# EAGLE design FPGA-m3pi (EAGLE 6.3)
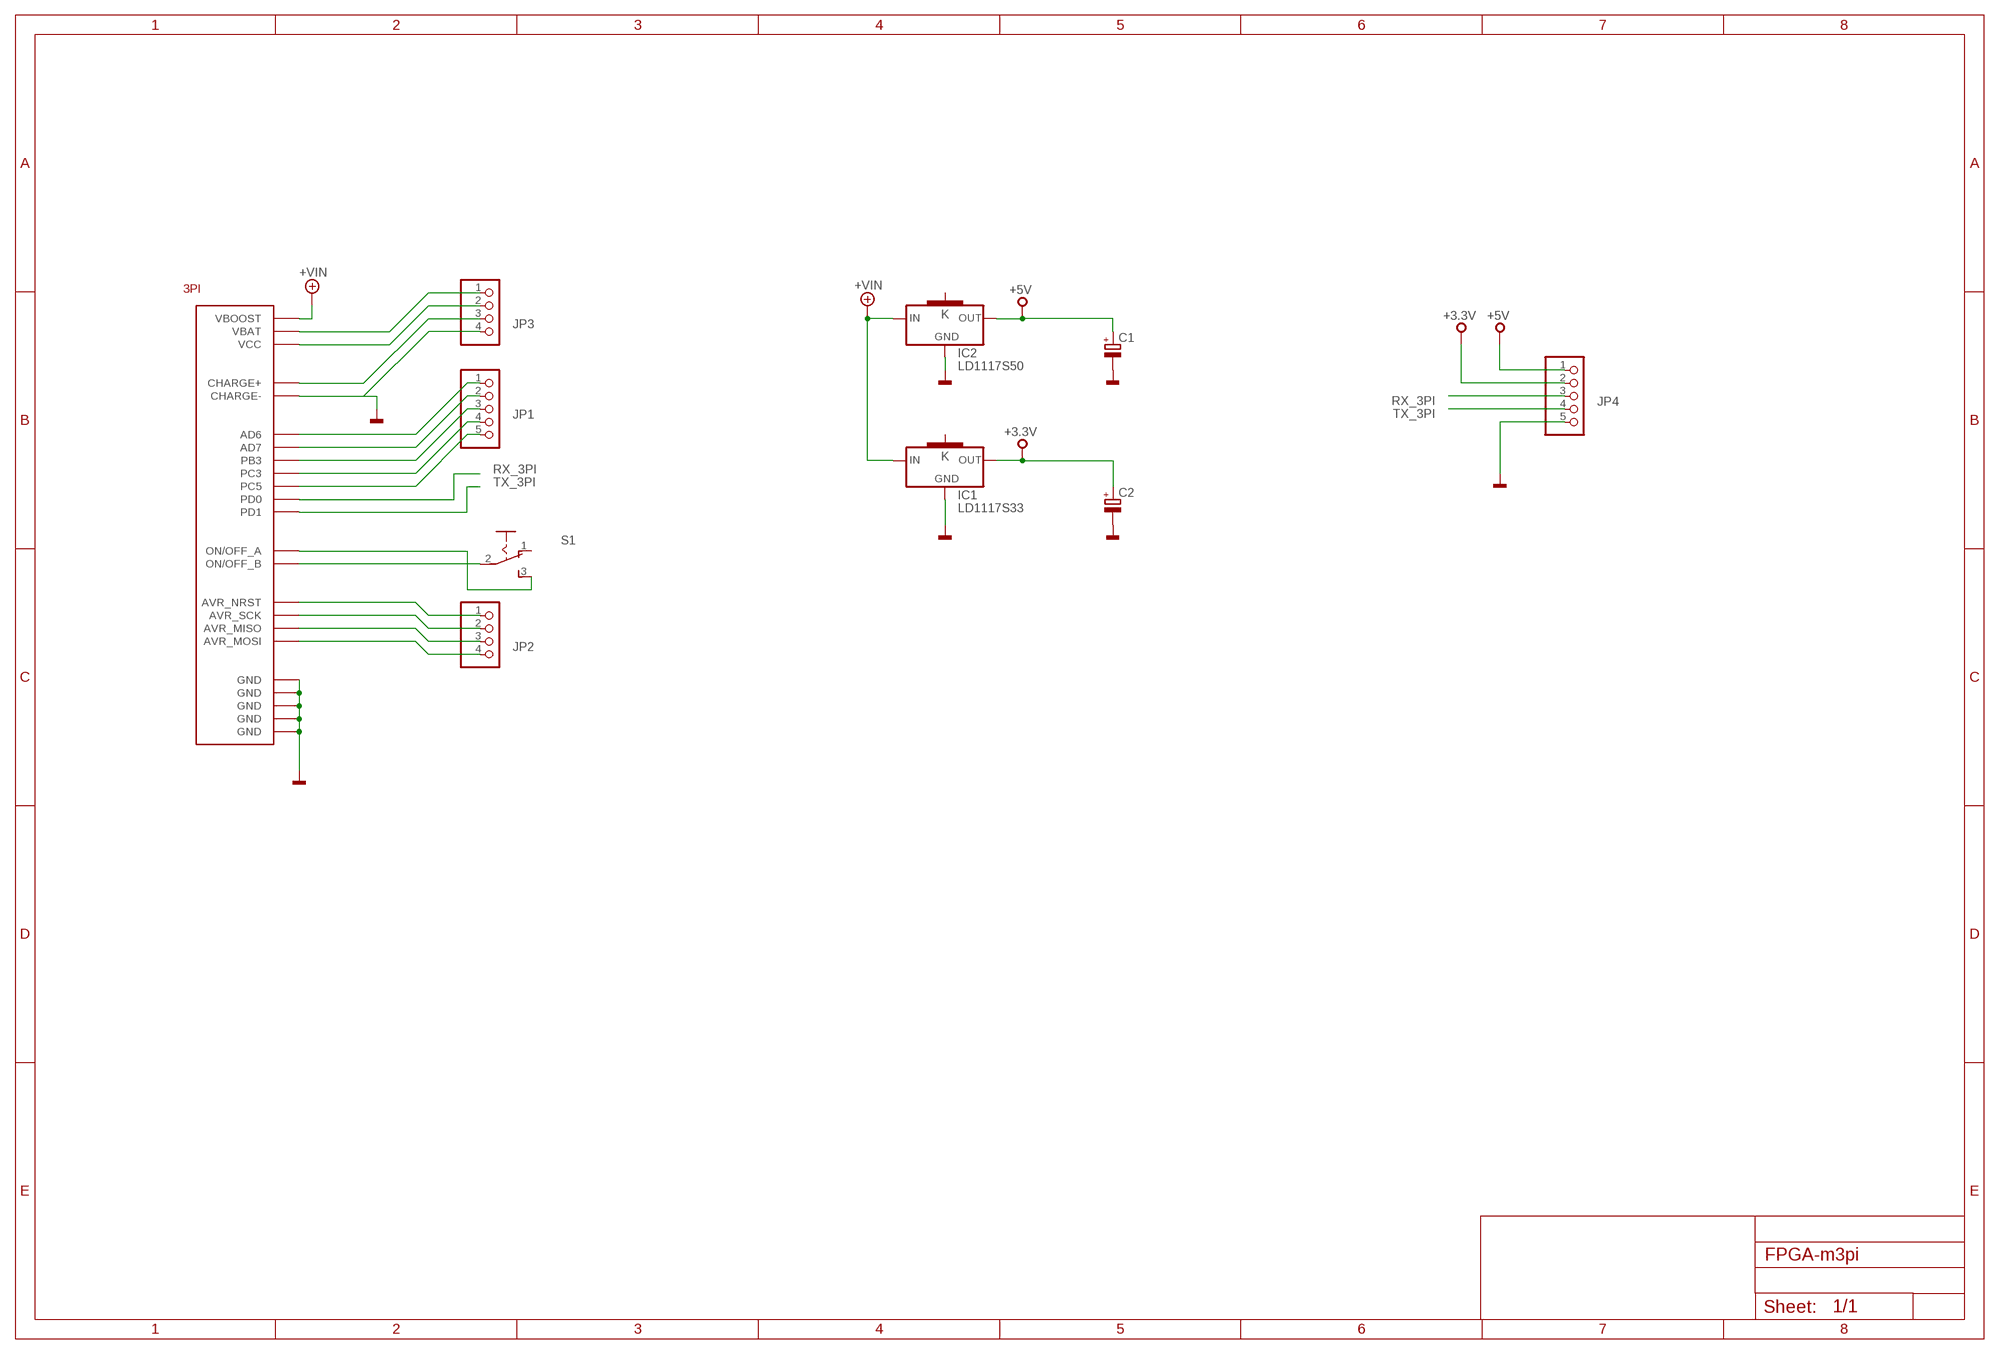
[diagram p0: schematic, sheet 1]

## Parts
C1  CPOL-EUE2.5-5  [E2,5-5]
C2  CPOL-EUE2.5-5  [E2,5-5]
IC1  LD1117S33  [SOT223]
IC2  LD1117S50  [SOT223]
JP1  PINHD-1X5  [1X05]
JP2  PINHD-1X4  [1X04]
JP3  PINHD-1X4  [1X04]
JP4  PINHD-1X5  [1X05]
S1  M251  [M251]
U$1  MBED-M3PI_3PI  [MBED-M3PI_3PI]

## Nets
+3,3V: C2.+ IC1.2(OUT) JP4.2 ; supply symbol labelled +3.3V
+5V: C1.+ IC2.2(OUT) JP4.1
+VIN: IC1.3(IN) IC2.3(IN) U$1.VBOOST
GND: C1.- C2.- IC1.1(GND) IC2.1(GND) JP3.4 JP4.5 U$1.CHARGE- U$1.GND@1(GND) U$1.GND@2(GND) U$1.GND@3(GND) U$1.GND@4(GND) U$1.GND@5(GND)
N$1: JP1.1 U$1.AD6
N$2: JP1.2 U$1.AD7
N$3: S1.2(P) U$1.ON/OFF_B
N$4: S1.3(S) U$1.ON/OFF_A
N$5: JP1.3 U$1.PB3
N$6: JP1.4 U$1.PC3
N$7: JP1.5 U$1.PC5
N$8: JP2.1 U$1.AVR_NRST
N$9: JP2.2 U$1.AVR_SCK
N$10: JP2.3 U$1.AVR_MISO
N$11: JP2.4 U$1.AVR_MOSI
N$12: JP3.3 U$1.CHARGE+
N$13: JP3.2 U$1.VCC
N$14: JP3.1 U$1.VBAT
RX_3PI: JP4.3 U$1.PD0
TX_3PI: JP4.4 U$1.PD1
Unconnected: IC1.4(K) IC2.4(K) S1.1(O)

## Library data of the parts
C1 C2 = rcl:CPOL-EU: POLARIZED CAPACITOR, European symbol
IC1 = mbed-ics:LD1117S33: VOLTAGE REGULATOR SMD 3,3V
IC2 = mbed-ics:LD1117S50: VOLTAGE REGULATOR SMD 5V
JP1 JP4 = pinhead:PINHD-1X5: PIN HEADER
JP2 JP3 = pinhead:PINHD-1X4: PIN HEADER
S1 = switch:M251: SLIDING SWITCH Mors, distributor Buerklin, 11G702
U$1 = m3pi:MBED-M3PI_3PI

## Board
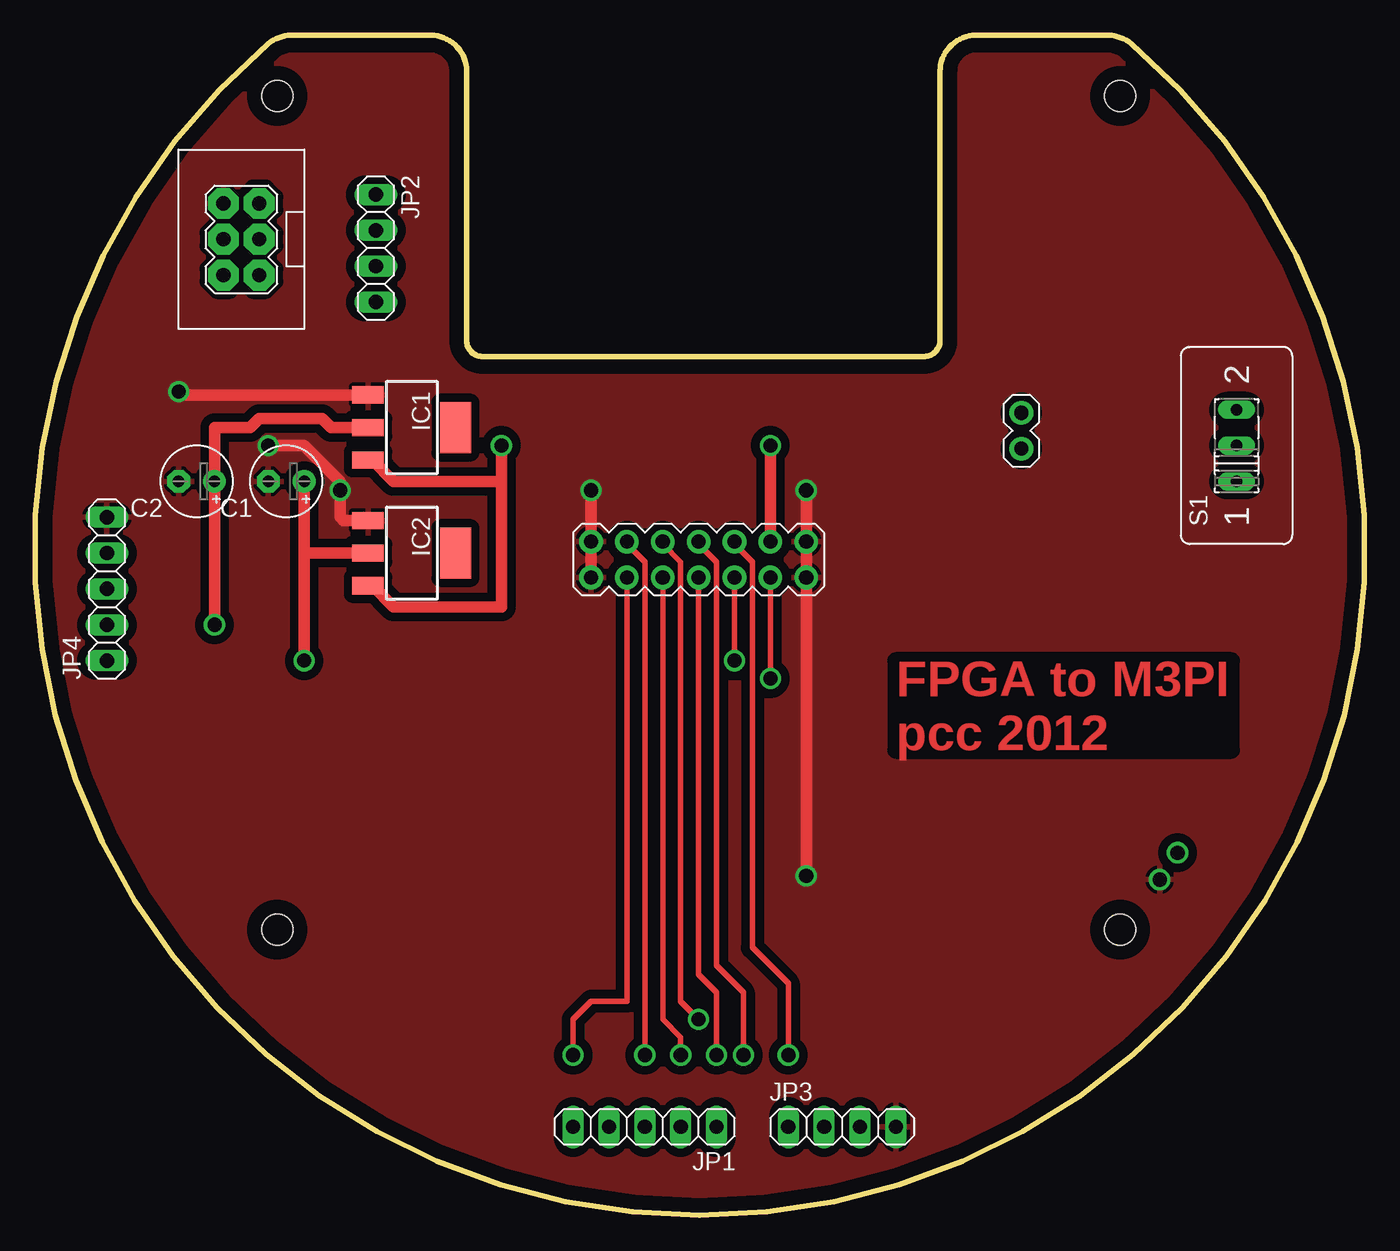
[diagram p1: board, top side]
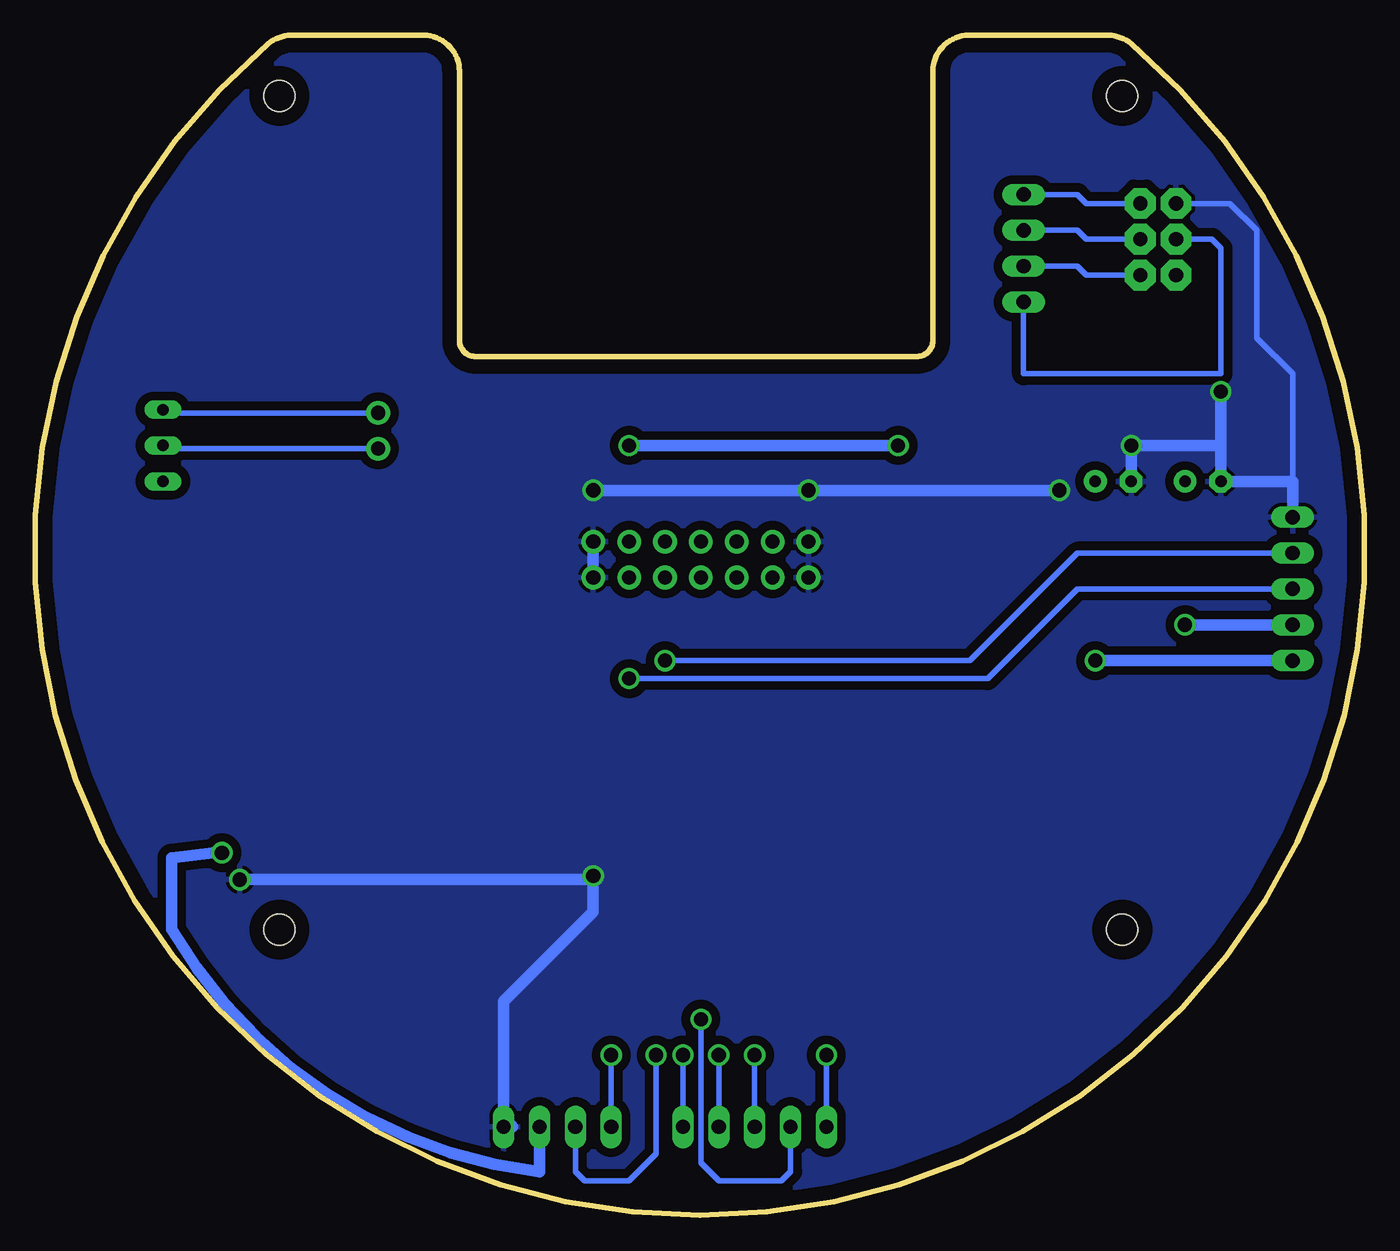
[diagram p2: board, bottom side, seen from below]

Size 94.12 x 83.58 mm. Coordinates in mm from the lower left corner, seen from the top.
Copper layers (1*16): Top 0.035mm / dielectric 1.5mm / Bottom 0.035mm
Design rules "default": minimum track width 10mil, minimum drill 24mil, track to track 8mil, track to pad 8mil, pad to pad 8mil, via to via 8mil, smd to smd 8mil, copper to edge 40mil, drill to drill 8mil, minimum pad ring 10mil, minimum via ring 8mil, stop-mask expansion 4mil, vias tented up to drill 0mil, thermal gap 10mil

### Footprints (pad centres in the part's own frame; a part is rotated, then mirrored left to right if it is on the bottom)
E2,5-5 = drill 0.813 pad 1.6: + -1.27,0 | drill 0.813 pad 1.6 octagon: - 1.27,0
SOT223 = smd 1.219 x 2.235: 1 -2.311,-3.099; 2 0,-3.099; 3 2.311,-3.099 | smd 3.6 x 2.2: 4 0,3.099
1X05 = drill 1.016 long: 1 -5.08,0; 2 -2.54,0; 3 0,0; 4 2.54,0; 5 5.08,0
1X04 = drill 1.016 long: 1 -3.81,0; 2 -1.27,0; 3 1.27,0; 4 3.81,0
M251 = drill 0.813 long: 1 -2.54,0; 2 0,0; 3 2.54,0
MBED-M3PI_3PI = drill 1 pad 1.676: AD6 0,-16.97; AD7 -2.54,-16.97; GND@1 -7.62,-14.43; GND@2 -7.62,-16.97; GND@3 7.62,-14.43; GND@4 7.62,-16.97; ON/OFF_A 22.86,-5.31; ON/OFF_B 22.86,-7.85; PB3 -5.08,-14.43; PC3 -2.54,-14.43; PC5 -5.08,-16.97; PD0 5.08,-16.97; PD1 2.54,-16.97; VBAT 2.54,-14.43; VBOOST 5.08,-14.43; VCC 0,-14.43 | drill 1 pad 2.184 octagon: AVR_MISO -31.115,4.445; AVR_MOSI -33.655,6.985; AVR_NRST -31.115,9.525; AVR_SCK -31.115,6.985; GND@5 -33.655,9.525; P$2 -33.655,4.445 | drill 1: CHARGE+ 33.925,-36.465; CHARGE- 32.655,-38.37 | hole 2.2: -29.845,-41.91; 29.845,-41.91; 29.845,17.145; -29.845,17.145

### Placement (x,y rotation side)
C1  17.77,51.98 180 top
C2  11.42,51.98 180 top
IC1  26.66,55.79 270 top
IC2  26.66,46.9 270 top
JP1  43.17,6.26 180 top
JP2  24.12,68.49 270 top
JP3  57.14,6.26 0 top
JP4  5.07,44.36 90 top
S1  85.08,54.52 90 top
U$1  46.98,62.14 0 top

### Tracks (layer width: path | path; a pad name or v marks a point on that pad's centre or on a via)
+3,3V  (via drill 1 pad 1.27)
  Top 0.813: v12.69,41.82 C2.+ 12.69,55.79 15.23,55.79 15.87,56.43 20.31,56.43 20.95,55.79 IC1.2
  Bottom 0.813: JP4.2 v12.69,41.82
+5V  (via drill 1 pad 1.27)
  Top 0.813: v19.04,39.28 19.04,46.9 | 19.04,46.9 C1.+ | IC2.2 19.04,46.9
  Bottom 0.813: JP4.1 v19.04,39.28
+VIN  (via drill 1 pad 1.27)
  Top 0.813: IC1.3 23.89,53.48 25.39,51.98 33.01,51.98 | IC2.3 23.89,44.59 25.39,43.09 33.01,43.09 33.01,51.98 | 33.01,51.98 v33.01,54.52 | v52.06,54.52 U$1.VBOOST
  Bottom 0.813: v33.01,54.52 v52.06,54.52
GND  (via drill 1 pad 1.27)
  Top 0.813: IC1.1 10.38,58.1 v10.15,58.33 | v16.5,54.52 19.04,54.52 21.58,51.98 v21.58,51.35 21.58,49.44 21.81,49.21 IC2.1 | v39.36,51.35 U$1.GND@1 U$1.GND@2 | v54.6,51.35 U$1.GND@4 v54.6,24.04
  Bottom 0.406: U$1.GND@5 9.52,71.67 7.61,69.76 7.61,62.14 5.07,59.6 5.07,51.98
  Bottom 0.813: JP4.5 5.07,51.98 C2.- 10.15,54.52 | 10.15,54.52 v16.5,54.52 C1.- | v10.15,58.33 10.15,54.52 | v21.58,51.35 v39.36,51.35 v54.6,51.35 | U$1.GND@4 U$1.GND@3 | JP3.4 60.32,6.26 60.95,6.9 60.95,15.15 54.6,21.5 v54.6,24.04 54.87,23.77 U$1.CHARGE-
  pour Bottom (isolate 0.61): -7.63,83.73 96.51,83.73 96.51,-2.63 -7.63,-2.63
  pour Top (isolate 0.61): -5.09,83.73 104.13,83.73 104.13,-2.63 -5.09,-2.63
N$1  (via drill 1 pad 1.27)
  Top 0.406: U$1.AD6 46.98,17.06 48.25,15.79 v48.25,11.34
  Bottom 0.406: v48.25,11.34 JP1.1
N$2  (via drill 1 pad 1.27)
  Top 0.406: U$1.AD7 44.44,15.15 44.44,13.88 45.71,12.61 v45.71,11.34
  Bottom 0.406: v45.71,11.34 JP1.2
N$3
  Bottom 0.406: U$1.ON/OFF_B 85.08,54.29 S1.2
N$4
  Bottom 0.406: U$1.ON/OFF_A 85.08,56.83 S1.3
N$5  (via drill 1 pad 1.27)
  Top 0.406: U$1.PB3 41.9,47.54 43.17,46.27 v43.17,11.34
  Bottom 0.406: v43.17,11.34 JP1.3
N$6  (via drill 1 pad 1.27)
  Top 0.406: U$1.PC3 44.44,47.54 45.71,46.27 45.71,15.15 v46.98,13.88
  Bottom 0.406: v46.98,13.88 46.98,3.72 45.71,2.45 41.27,2.45 40.63,3.09 JP1.4
N$7  (via drill 1 pad 1.27)
  Top 0.406: U$1.PC5 41.9,15.15 39.36,15.15 38.09,13.88 v38.09,11.34
  Bottom 0.406: v38.09,11.34 JP1.5
N$8
  Bottom 0.406: U$1.AVR_NRST 19.68,71.67 20.31,72.3 JP2.1
N$9
  Bottom 0.406: U$1.AVR_SCK 19.68,69.13 20.31,69.76 JP2.2
N$10
  Bottom 0.406: U$1.AVR_MISO 19.68,66.59 20.31,67.22 JP2.3
N$11
  Bottom 0.406: U$1.AVR_MOSI 10.79,69.13 10.15,68.49 10.15,59.6 24.12,59.6 JP2.4
N$12
  Bottom 0.813: U$1.CHARGE+ 81.54,25.68 84.45,25.31 84.45,20.23 arc-53 58.41,3.09 JP3.3
N$13  (via drill 1 pad 1.27)
  Top 0.406: U$1.VCC 46.98,47.54 48.25,46.27 48.25,17.69 50.16,15.79 v50.16,11.34
  Bottom 0.406: v50.16,11.34 50.16,4.36 52.06,2.45 55.24,2.45 55.87,3.09 JP3.2
N$14  (via drill 1 pad 1.27)
  Top 0.406: U$1.VBAT 49.52,47.54 50.79,46.27 50.79,18.96 53.33,16.42 v53.33,11.34
  Bottom 0.406: v53.33,11.34 JP3.1
RX_3PI  (via drill 1 pad 1.27)
  Top 0.406: v52.06,38.01 U$1.PD0
  Bottom 0.406: JP4.3 20.31,44.36 26.66,38.01 v52.06,38.01
TX_3PI  (via drill 1 pad 1.27)
  Top 0.406: v49.52,39.28 U$1.PD1
  Bottom 0.406: JP4.4 20.31,46.9 27.93,39.28 v49.52,39.28

### Text on the board
Top: FPGA to M3PI / pcc 2012